# Altium project Condor2a.PrjPcb
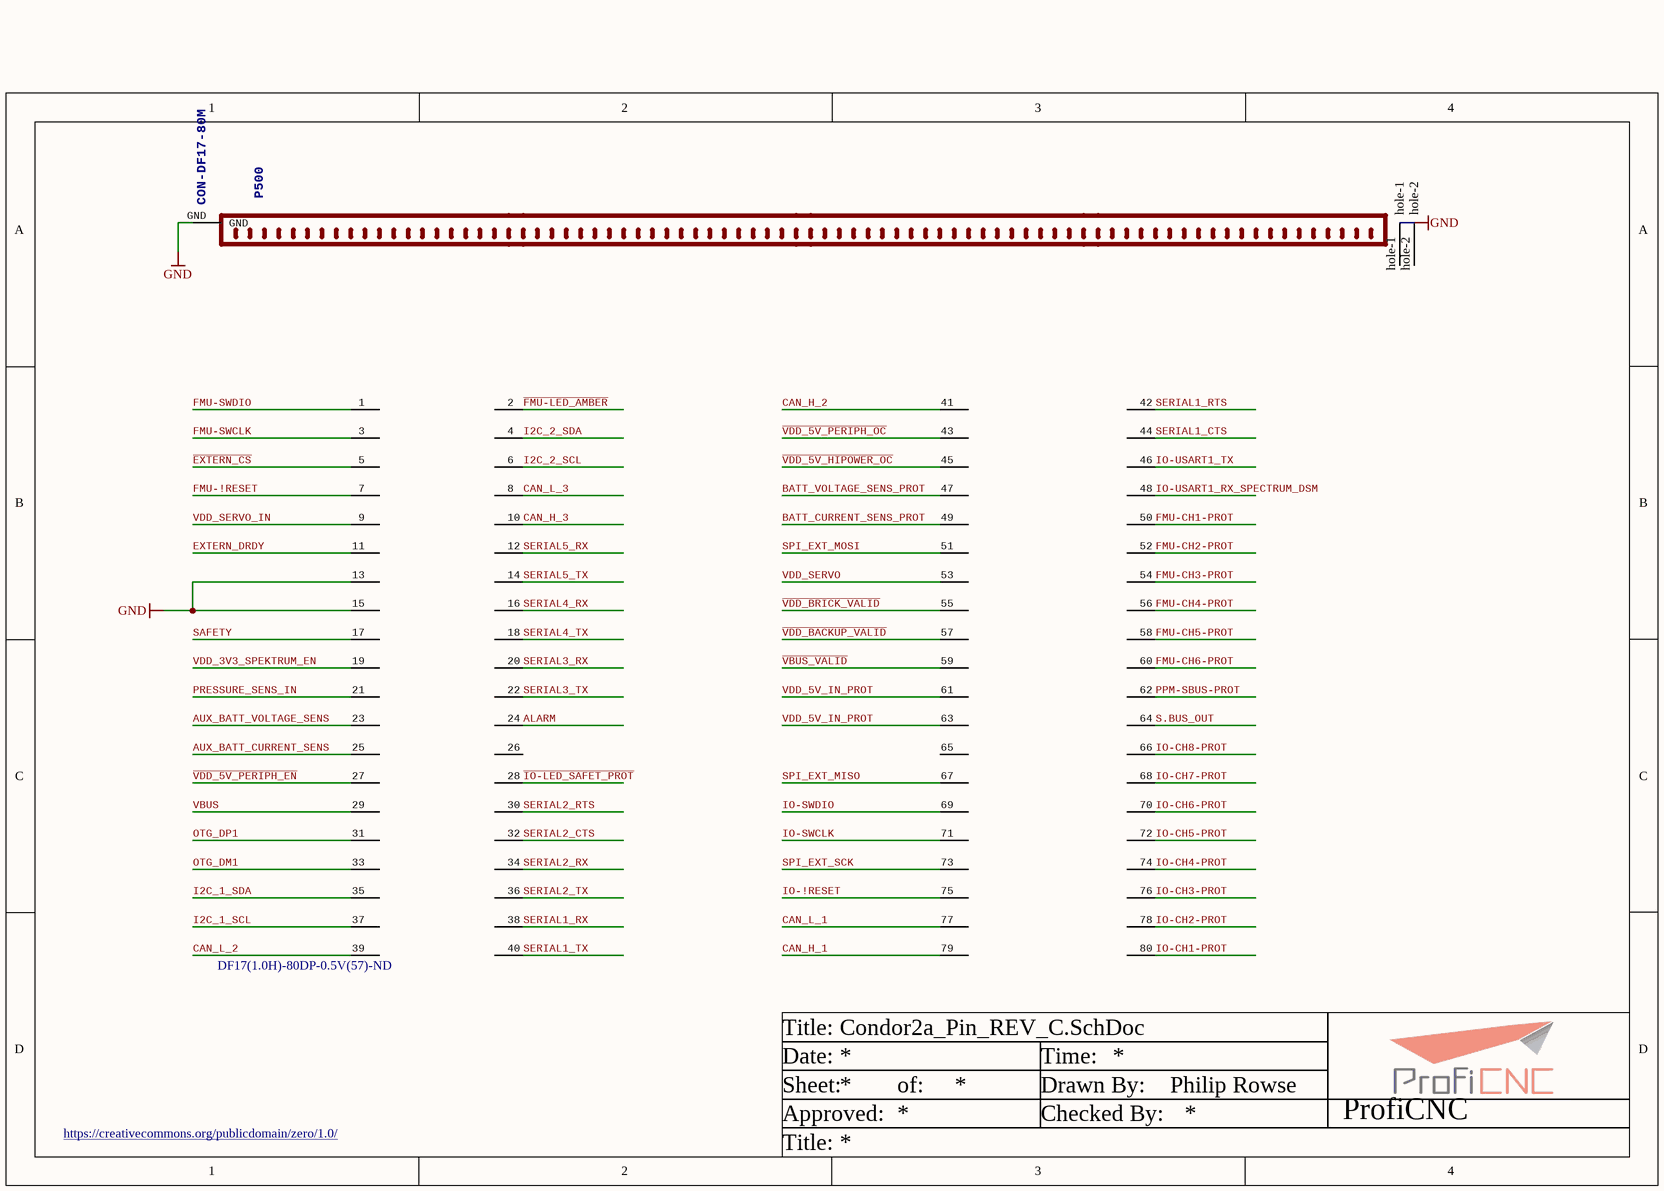
[diagram p0: Condor2a_Pin_REV_C.SchDoc]
10 sheets, 84 parts. Net scope: global (net labels, ports and power ports of the same name join across sheets).
Board file: Condor2a.PcbDoc
Sheets:
  Condor2a_Pin_REV_C.SchDoc
  Condor2a_INTEL_REV_C.SchDoc
  Condor2a_Plugs_REV_C.SchDoc
  Condor2a_Power_REV_C.SchDoc
  Condor2a_Servo_REV_C.SchDoc
  Condor2a_tp_REV_C.SchDoc
  Condor2a_ESC.SchDoc
  Condor2a_Power_Module.SchDoc
  Condor2a_Current_Sensor.SchDoc
  Condor2a_Herlink.SchDoc

## Sheet Condor2a_Pin_REV_C.SchDoc
size A4; DrawnBy: Philip Rowse

### Parts
P500  CON-DF17-80M  Supplier Part Number 1: DF17(1.0H)-80DP-0.5V(57)-ND  [CON-DF17-80M]

### Nets
GND: P500.13 P500.15 P500.GND
ALARM: P500.24
AUX_BATT_CURRENT_SENS: P500.25
AUX_BATT_VOLTAGE_SENS: P500.23
BATT_CURRENT_SENS_PROT: P500.49
BATT_VOLTAGE_SENS_PROT: P500.47
CAN_H_1: P500.79
CAN_H_2: P500.41
CAN_H_3: P500.10
CAN_L_1: P500.77
CAN_L_2: P500.39
CAN_L_3: P500.8
~{EXTERN_CS}: P500.5
EXTERN_DRDY: P500.11
~{FMU-LED_AMBER}: P500.2
FMU-!RESET: P500.7
FMU-CH1-PROT: P500.50
FMU-CH2-PROT: P500.52
FMU-CH3-PROT: P500.54
FMU-CH4-PROT: P500.56
FMU-CH5-PROT: P500.58
FMU-CH6-PROT: P500.60
FMU-SWCLK: P500.3
FMU-SWDIO: P500.1
I2C_1_SCL: P500.37
I2C_1_SDA: P500.35
I2C_2_SCL: P500.6
I2C_2_SDA: P500.4
~{IO-LED_SAFET_PROT}: P500.28
IO-!RESET: P500.75
IO-CH1-PROT: P500.80
IO-CH2-PROT: P500.78
IO-CH3-PROT: P500.76
IO-CH4-PROT: P500.74
IO-CH5-PROT: P500.72
IO-CH6-PROT: P500.70
IO-CH7-PROT: P500.68
IO-CH8-PROT: P500.66
IO-SWCLK: P500.71
IO-SWDIO: P500.69
IO-USART1_RX_SPECTRUM_DSM: P500.48
IO-USART1_TX: P500.46
OTG_DM1: P500.33
OTG_DP1: P500.31
PPM-SBUS-PROT: P500.62
PRESSURE_SENS_IN: P500.21
S.BUS_OUT: P500.64
SAFETY: P500.17
SERIAL1_CTS: P500.44
SERIAL1_RTS: P500.42
SERIAL1_RX: P500.38
SERIAL1_TX: P500.40
SERIAL2_CTS: P500.32
SERIAL2_RTS: P500.30
SERIAL2_RX: P500.34
SERIAL2_TX: P500.36
SERIAL3_RX: P500.20
SERIAL3_TX: P500.22
SERIAL4_RX: P500.16
SERIAL4_TX: P500.18
SERIAL5_RX: P500.12
SERIAL5_TX: P500.14
SPI_EXT_MISO: P500.67
SPI_EXT_MOSI: P500.51
SPI_EXT_SCK: P500.73
~{VBUS_VALID}: P500.59
~{VDD_5V_HIPOWER_OC}: P500.45
~{VDD_5V_PERIPH_EN}: P500.27
~{VDD_5V_PERIPH_OC}: P500.43
~{VDD_BACKUP_VALID}: P500.57
~{VDD_BRICK_VALID}: P500.55
VBUS: P500.29
VDD_3V3_SPEKTRUM_EN: P500.19
VDD_5V_IN_PROT: P500.61 P500.63
VDD_SERVO: P500.53
VDD_SERVO_IN: P500.9

Not connected (* = marked no-connect by the designer): P500 26 65 hole-1 hole-2

### Notes on the sheet
- Title:
- Date:
- Time:
- https://creativecommons.org/publicdomain/zero/1.0/
- Sheet:
- Approved:
- of:
- Drawn By:
- Checked By:
- ProfiCNC

### Library data of the parts
P500 = CON-DF17-80M: Connector, Header, 80Pos, .5MM, DUAL, SMD, Au; Supplier 1: Digi-Key

## Sheet Condor2a_INTEL_REV_C.SchDoc
size A4; DrawnBy: Philip Rowse

### Notes on the sheet
- Title:
- Date:
- Time:
- https://creativecommons.org/publicdomain/zero/1.0/
- Sheet:
- Approved:
- of:
- Drawn By:
- Checked By:
- ProfiCNC

## Sheet Condor2a_Plugs_REV_C.SchDoc
size A4; DrawnBy: Philip Rowse
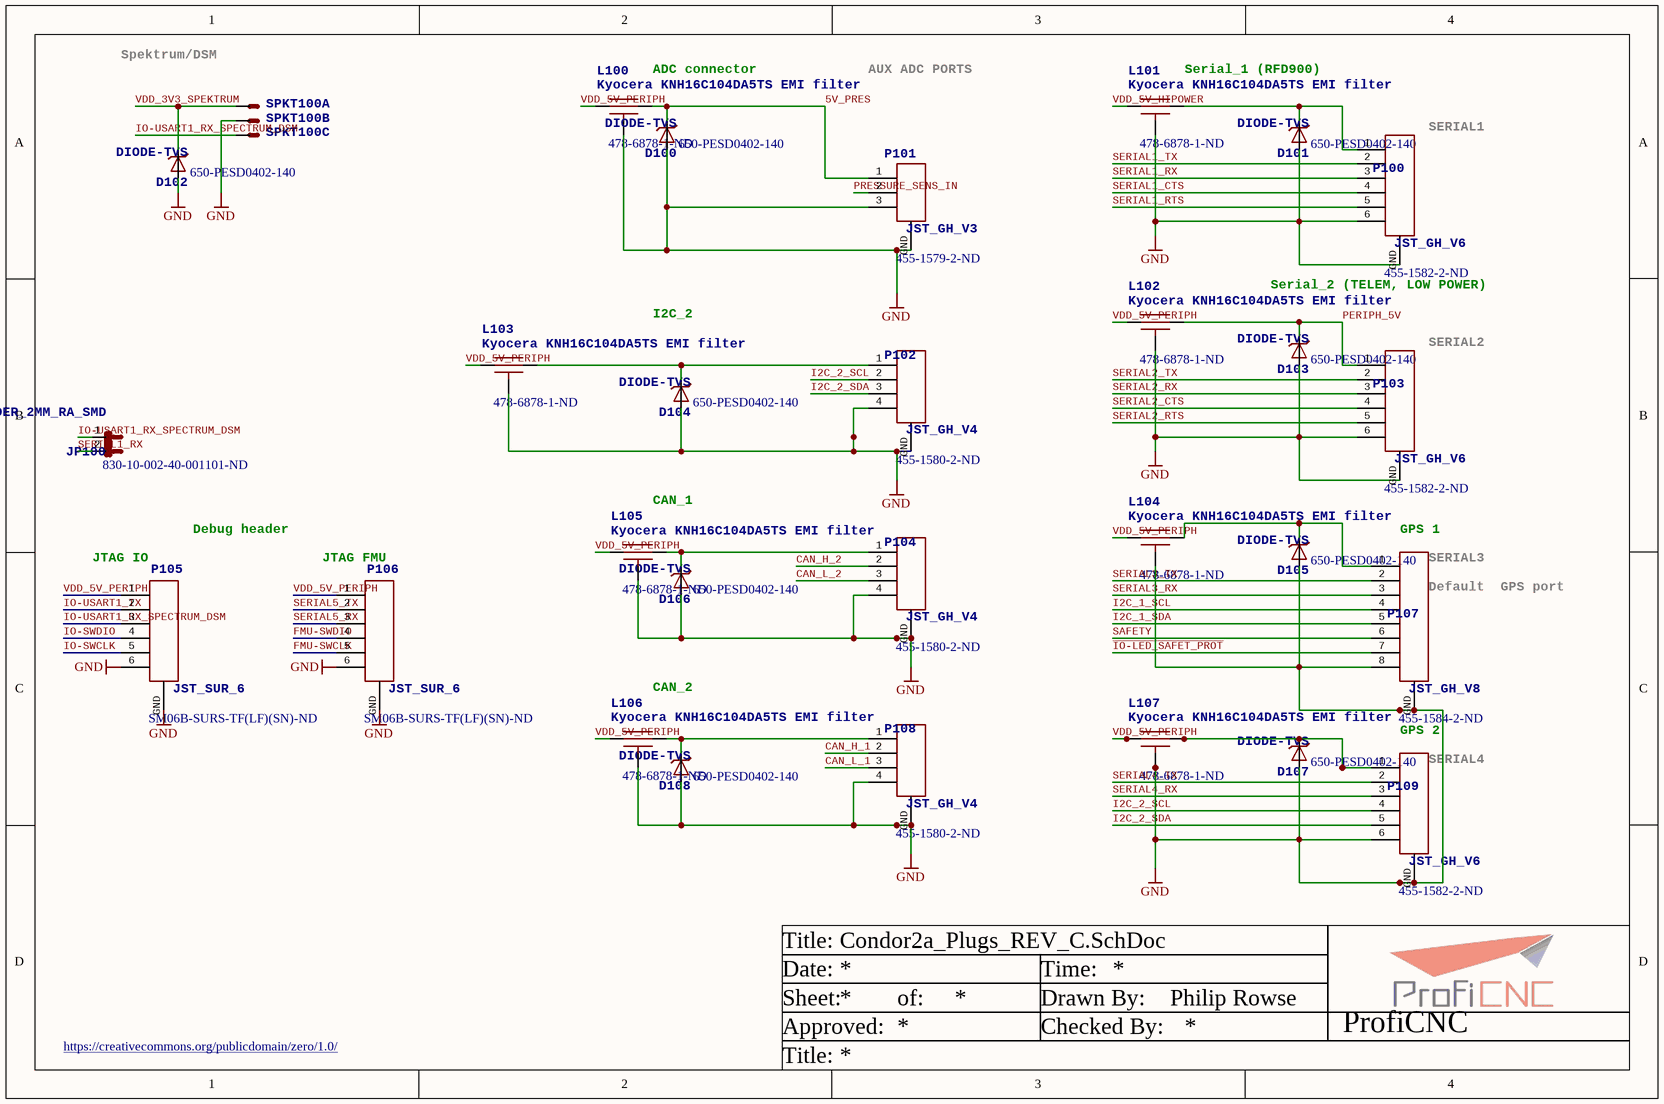
[diagram p1: Condor2a_Plugs_REV_C.SchDoc]

### Parts
D100  DIODE-TVS  Supplier Part Number 1: 650-PESD0402-140  [0402-TVS]
D101  DIODE-TVS  Supplier Part Number 1: 650-PESD0402-140  [0402-TVS]
D102  DIODE-TVS  Supplier Part Number 1: 650-PESD0402-140  [0402-TVS]
D103  DIODE-TVS  Supplier Part Number 1: 650-PESD0402-140  [0402-TVS]
D104  DIODE-TVS  Supplier Part Number 1: 650-PESD0402-140  [0402-TVS]
D105  DIODE-TVS  Supplier Part Number 1: 650-PESD0402-140  [0402-TVS]
D106  DIODE-TVS  Supplier Part Number 1: 650-PESD0402-140  [0402-TVS]
D107  DIODE-TVS  Supplier Part Number 1: 650-PESD0402-140  [0402-TVS]
D108  DIODE-TVS  Supplier Part Number 1: 650-PESD0402-140  [0402-TVS]
JP100  HEADER_2MM_RA_SMD  Supplier Part Number 1: 830-10-002-40-001101-ND  [HEADER_2MM_RA_2]
L100  Kyocera KNH16C104DA5TS EMI filter  Supplier Part Number 1: 478-6878-1-ND  [KYOCERA-KNH16-DA]
L101  Kyocera KNH16C104DA5TS EMI filter  Supplier Part Number 1: 478-6878-1-ND  [KYOCERA-KNH16-DA]
L102  Kyocera KNH16C104DA5TS EMI filter  Supplier Part Number 1: 478-6878-1-ND  [KYOCERA-KNH16-DA]
L103  Kyocera KNH16C104DA5TS EMI filter  Supplier Part Number 1: 478-6878-1-ND  [KYOCERA-KNH16-DA]
L104  Kyocera KNH16C104DA5TS EMI filter  Supplier Part Number 1: 478-6878-1-ND  [KYOCERA-KNH16-DA]
L105  Kyocera KNH16C104DA5TS EMI filter  Supplier Part Number 1: 478-6878-1-ND  [KYOCERA-KNH16-DA]
L106  Kyocera KNH16C104DA5TS EMI filter  Supplier Part Number 1: 478-6878-1-ND  [KYOCERA-KNH16-DA]
L107  Kyocera KNH16C104DA5TS EMI filter  Supplier Part Number 1: 478-6878-1-ND  [KYOCERA-KNH16-DA]
P100  JST_GH_V6  Supplier Part Number 1: 455-1582-2-ND  [JST_GH_V6]
P101  JST_GH_V3  Supplier Part Number 1: 455-1579-2-ND  [JST_GH_V3]
P102  JST_GH_V4  Supplier Part Number 1: 455-1580-2-ND  [JST_GH_V4]
P103  JST_GH_V6  Supplier Part Number 1: 455-1582-2-ND  [JST_GH_V6]
P104  JST_GH_V4  Supplier Part Number 1: 455-1580-2-ND  [JST_GH_V4]
P105  JST_SUR_6  Supplier Part Number 1: SM06B-SURS-TF(LF)(SN)-ND  [JST_SUR_H6]
P106  JST_SUR_6  Supplier Part Number 1: SM06B-SURS-TF(LF)(SN)-ND  [JST_SUR_H6]
P107  JST_GH_V8  Supplier Part Number 1: 455-1584-2-ND  [JST_GH_V8]
P108  JST_GH_V4  Supplier Part Number 1: 455-1580-2-ND  [JST_GH_V4]
P109  JST_GH_V6  Supplier Part Number 1: 455-1582-2-ND  [JST_GH_V6]
SPKT100  CONN_SPEKTRUM_RX-TH  [B3B-ZR]  (value not drawn)  (parts A,B,C of 3)

### Nets
GND: D100.A D101.A D102.A D103.A D104.A D105.A D106.A D107.A D108.A L100.GND L101.GND L102.GND L103.GND L104.GND L105.GND L106.GND L107.GND P100.6 P100.GND P101.3 P101.GND P102.4 P102.GND P103.6 P103.GND P104.4 P104.GND P105.6 P105.GND P106.6 P106.GND P107.8 P107.GND P108.4 P108.GND P109.6 P109.GND SPKT100.2(S)
5V_PRES: D100.C L100.P$2 P101.1
CAN_H_1: P108.2
CAN_H_2: P104.2
CAN_L_1: P108.3
CAN_L_2: P104.3
FMU-SWCLK: P106.5
FMU-SWDIO: P106.4
I2C_1_SCL: P107.4
I2C_1_SDA: P107.5
I2C_2_SCL: P102.2 P109.4
I2C_2_SDA: P102.3 P109.5
~{IO-LED_SAFET_PROT}: P107.7
IO-SWCLK: P105.5
IO-SWDIO: P105.4
IO-USART1_RX_SPECTRUM_DSM: JP100.1 P105.3 SPKT100.1(S)
IO-USART1_TX: P105.2
PERIPH_5V: D103.C L102.P$2 P103.1
PRESSURE_SENS_IN: P101.2
SAFETY: P107.6
SERIAL1_CTS: P100.4
SERIAL1_RTS: P100.5
SERIAL1_RX: JP100.2 P100.3
SERIAL1_TX: P100.2
SERIAL2_CTS: P103.4
SERIAL2_RTS: P103.5
SERIAL2_RX: P103.3
SERIAL2_TX: P103.2
SERIAL3_RX: P107.3
SERIAL3_TX: P107.2
SERIAL4_RX: P109.3
SERIAL4_TX: P109.2
SERIAL5_RX: P106.3
SERIAL5_TX: P106.2
VDD_3V3_SPEKTRUM: D102.C SPKT100.3(S)
VDD_5V_HIPOWER: L101.P$1
VDD_5V_PERIPH: L100.P$1 L102.P$1 L103.P$1 L104.P$1 L105.P$1 L106.P$1 L107.P$1 P105.1 P106.1
NetD101_C: D101.C L101.P$2 P100.1
NetD104_C: D104.C L103.P$2 P102.1
NetD105_C: D105.C L104.P$2 P107.1
NetD106_C: D106.C L105.P$2 P104.1
NetD107_C: D107.C L107.P$2 P109.1
NetD108_C: D108.C L106.P$2 P108.1

### Notes on the sheet
- Spektrum/DSM
- (near L100) ADC connector
- AUX ADC PORTS
- (near L101) Serial_1 (RFD900)
- (near P100) SERIAL1
- I2C_2
- Serial_2 (TELEM, LOW POWER)
- (near P103) SERIAL2
- Debug header
- (near L105) CAN_1
- (near P107) GPS 1
- (near P105) JTAG IO
- (near P106) JTAG FMU
- (near P107) SERIAL3
- (near P107) Default
  GPS port
- (near L106) CAN_2
- GPS 2
- (near P109) SERIAL4
- Title:
- Date:
- Time:
- https://creativecommons.org/publicdomain/zero/1.0/
- Sheet:
- Approved:
- of:
- Drawn By:
- Checked By:
- ProfiCNC

### Library data of the parts
D100-D108 = DIODE-TVS: Diode, TVS, 14VWM, 40VC, 0402, SMD; Supplier 1: Mouser
JP100 = HEADER_2MM_RA_SMD: Connector, PCB, 2MM, 2Pos, R/A, SMD, Au; Supplier 1: Digi-Key
L100-L107 = KNH16C104DA5TS: Capacitor, Filter, 0.1uF, 25V, 2A, 0603, SMD; Supplier 1: Digi-Key
P100 P103 P109 = JST_GH_V6: BM06B-GHS-TBT; Supplier 1: Digi-Key
P101 = JST_GH_V3: BM03B-GHS-TBT; Supplier 1: Digi-Key
P102 P104 P108 = JST_GH_V4: BM04B-GHS-TBT; Supplier 1: Digi-Key
P105 P106 = JST_SUR_6: Connector, Header, 6Pos, .8mm IDC, R/A, SMD, Tin; Supplier 1: Digi-Key
P107 = JST_GH_V8: BM08B-GHS-TBT; Supplier 1: Digi-Key
SPKT100 = CONN_SPEKTRUM_RX-TH: Spektrum RX connector; JST ZH series S3B-ZR-SM4A-TF; PARTNO: B3B-ZR(LF)(SN)

## Sheet Condor2a_Power_REV_C.SchDoc
size A4; DrawnBy: Philip Rowse
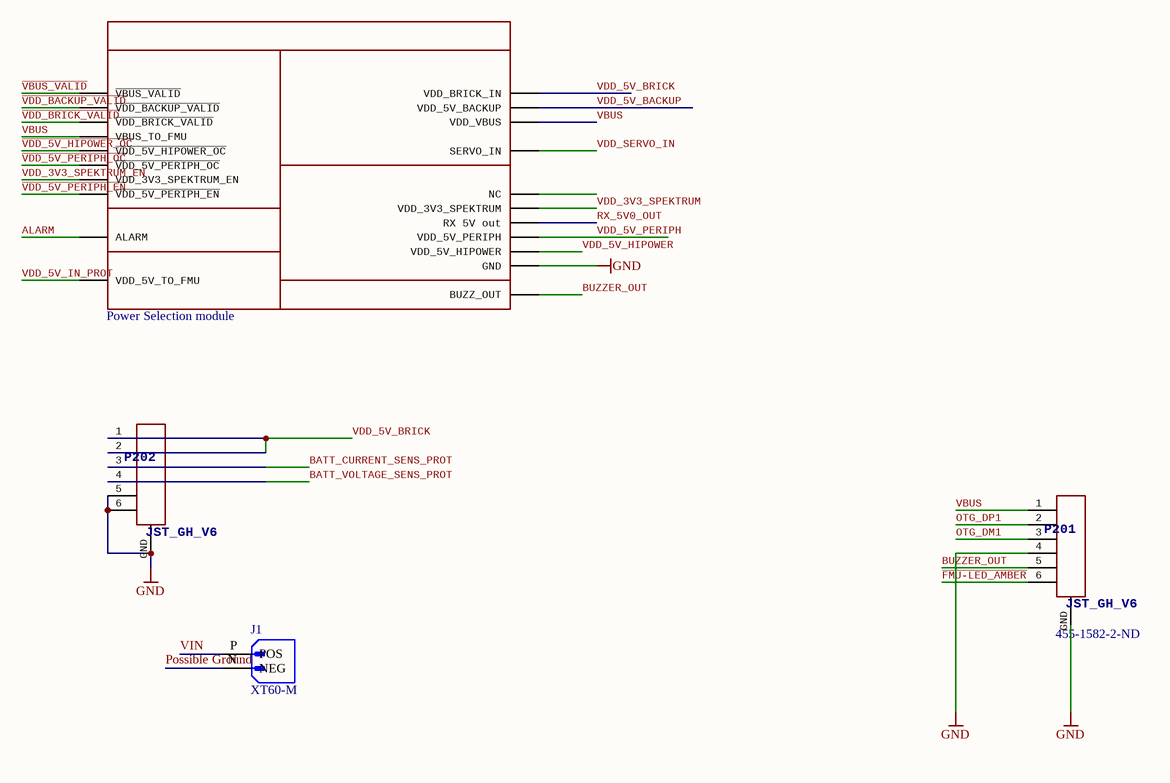
[diagram p2: Condor2a_Power_REV_C.SchDoc]

### Parts
J1  XT60-M  [AMASS_XT60-M]
P201  JST_GH_V6  Supplier Part Number 1: 455-1582-2-ND  [JST_GH_V6]
P202  JST_GH_V6  [JST_GH_V6]
PSM200  Power Selection module  [PSM]

### Nets
GND: P201.4 P201.GND P202.5 P202.6 P202.GND PSM200.GND
ALARM: PSM200.ALARM
BATT_CURRENT_SENS_PROT: P202.3
BATT_VOLTAGE_SENS_PROT: P202.4
BUZZER_OUT: P201.5 PSM200.BUZZER_OUT(BUZZ_OUT)
~{FMU-LED_AMBER}: P201.6
OTG_DM1: P201.3
OTG_DP1: P201.2
Possible Ground : J1.N(NEG)
RX_5V0_OUT: PSM200.RX(RX_5V_out)
~{VBUS_VALID}: PSM200.!VBUS_VALID(~{VBUS_VALID})
~{VDD_5V_HIPOWER_OC}: PSM200.!VDD_5V_HIPOWER_OC(~{VDD_5V_HIPOWER_OC})
~{VDD_5V_PERIPH_EN}: PSM200.!VDD_5V_PERIPH_EN(~{VDD_5V_PERIPH_EN})
~{VDD_5V_PERIPH_OC}: PSM200.!VDD_5V_PERIPH_OC(~{VDD_5V_PERIPH_OC})
~{VDD_BACKUP_VALID}: PSM200.!VDD_BACKUP_VALID(~{VDD_BACKUP_VALID})
~{VDD_BRICK_VALID}: PSM200.!VDD_BRICK_VALID(~{VDD_BRICK_VALID})
VBUS: P201.1 PSM200.VBUS(VBUS_TO_FMU) PSM200.VDD_VBUS
VDD_3V3_SPEKTRUM: PSM200.SPEK(VDD_3V3_SPEKTRUM)
VDD_3V3_SPEKTRUM_EN: PSM200.VDD_3V3_SPEKTRUM_EN
VDD_5V_BACKUP: PSM200.VDD_5V_BACKUP
VDD_5V_BRICK: P202.1 P202.2 PSM200.VDD_BRICK_IN
VDD_5V_HIPOWER: PSM200.5V_HIPOWER(VDD_5V_HIPOWER)
VDD_5V_IN_PROT: PSM200.VDD_5V_IN_PROT(VDD_5V_TO_FMU)
VDD_5V_PERIPH: PSM200.5V_PERIPH(VDD_5V_PERIPH)
VDD_SERVO_IN: PSM200.SERVO_IN
VIN: J1.P(POS)

Not connected (* = marked no-connect by the designer): PSM200 NC

### Notes on the sheet
- Title:
- Date:
- Time:
- https://creativecommons.org/publicdomain/zero/1.0/
- Sheet:
- Approved:
- of:
- Drawn By:
- Checked By:
- ProfiCNC

### Library data of the parts
J1 = XT60-M: Plug; DC supply; XT60; male; PIN: 2; for cable; soldered; 30A; 500V; MF: AMASS; Price: None; Availability: Not in stock; Package: Package; MP: XT60-M; Value: *; SnapEDA_Link: https://www.snapeda.com/parts/XT60-M/AMASS/view-part/?ref=snap; Check_prices: https://www.snapeda.com/parts/XT60-M/AMASS/view-part/?ref=eda
P201 P202 = JST_GH_V6: BM06B-GHS-TBT; Supplier 1: Digi-Key
PSM200 = PSMPSM: PCA, PSM, Assembly

## Sheet Condor2a_Servo_REV_C.SchDoc
size A4; DrawnBy: Philip Rowse
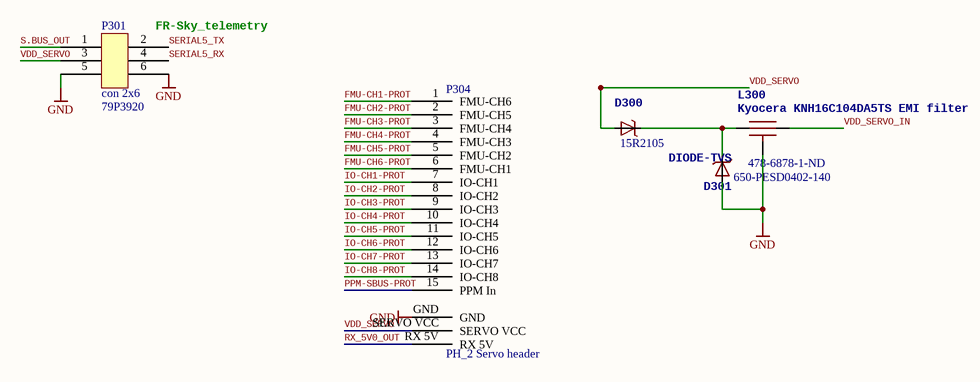
[diagram p3: Condor2a_Servo_REV_C.SchDoc]

### Parts
D300  Supplier Part Number 1: 15R2105  [MICROSMP]  (hidden comment: MSS1P4-M3)
D301  DIODE-TVS  Supplier Part Number 1: 650-PESD0402-140  [0402-TVS]
L300  Kyocera KNH16C104DA5TS EMI filter  Supplier Part Number 1: 478-6878-1-ND  [KYOCERA-KNH16-DA]
P301  con 2x6  Supplier Part Number 1: 79P3920  [TSW-103-07-G-D]
P304  PH_2 Servo header  [TSW-115-08-G-T-RA]

### Nets
GND: D301.A L300.GND P301.5 P301.6 P304.GND
FMU-CH1-PROT: P304.1(FMU-CH6)
FMU-CH2-PROT: P304.2(FMU-CH5)
FMU-CH3-PROT: P304.3(FMU-CH4)
FMU-CH4-PROT: P304.4(FMU-CH3)
FMU-CH5-PROT: P304.5(FMU-CH2)
FMU-CH6-PROT: P304.6(FMU-CH1)
IO-CH1-PROT: P304.7(IO-CH1)
IO-CH2-PROT: P304.8(IO-CH2)
IO-CH3-PROT: P304.9(IO-CH3)
IO-CH4-PROT: P304.10(IO-CH4)
IO-CH5-PROT: P304.11(IO-CH5)
IO-CH6-PROT: P304.12(IO-CH6)
IO-CH7-PROT: P304.13(IO-CH7)
IO-CH8-PROT: P304.14(IO-CH8)
PPM-SBUS-PROT: P304.15(PPM_In)
RX_5V0_OUT: P304.RX_5V
S.BUS_OUT: P301.1
SERIAL5_RX: P301.4
SERIAL5_TX: P301.2
VDD_SERVO: D300.ANODE(A) P301.3 P304.SERVO_VCC
VDD_SERVO_IN: L300.P$2
NetD300_CATHODE: D300.CATHODE(C) D301.C L300.P$1

### Notes on the sheet
- (near P301) FR-Sky_telemetry
- Title
- Size:
- Date:
- A4
- Number:
- Time:
- Revision:
- Sheet
- of
- File:

### Library data of the parts
D300 = DIODE-SCHOTTKY_MSMP: Diode, Schottky, 40V, 1A, MicroSMP, SMD; Supplier 1: Newark
D301 = DIODE-TVS: Diode, TVS, 14VWM, 40VC, 0402, SMD; Supplier 1: Mouser
L300 = KNH16C104DA5TS: as L100 on sheet Condor2a_Plugs_REV_C; Supplier 1: Digi-Key
P301 = con 2x6: Connector, Header, 6Pos, 2.54MM, Vert, THT, Au; Supplier 1: Newark
P304 = PH_2 Servo header: Connector, Header, 45Pos, 2.54MM, R/A, THT, Tin

## Sheet Condor2a_tp_REV_C.SchDoc
size A4; DrawnBy: Philip Rowse
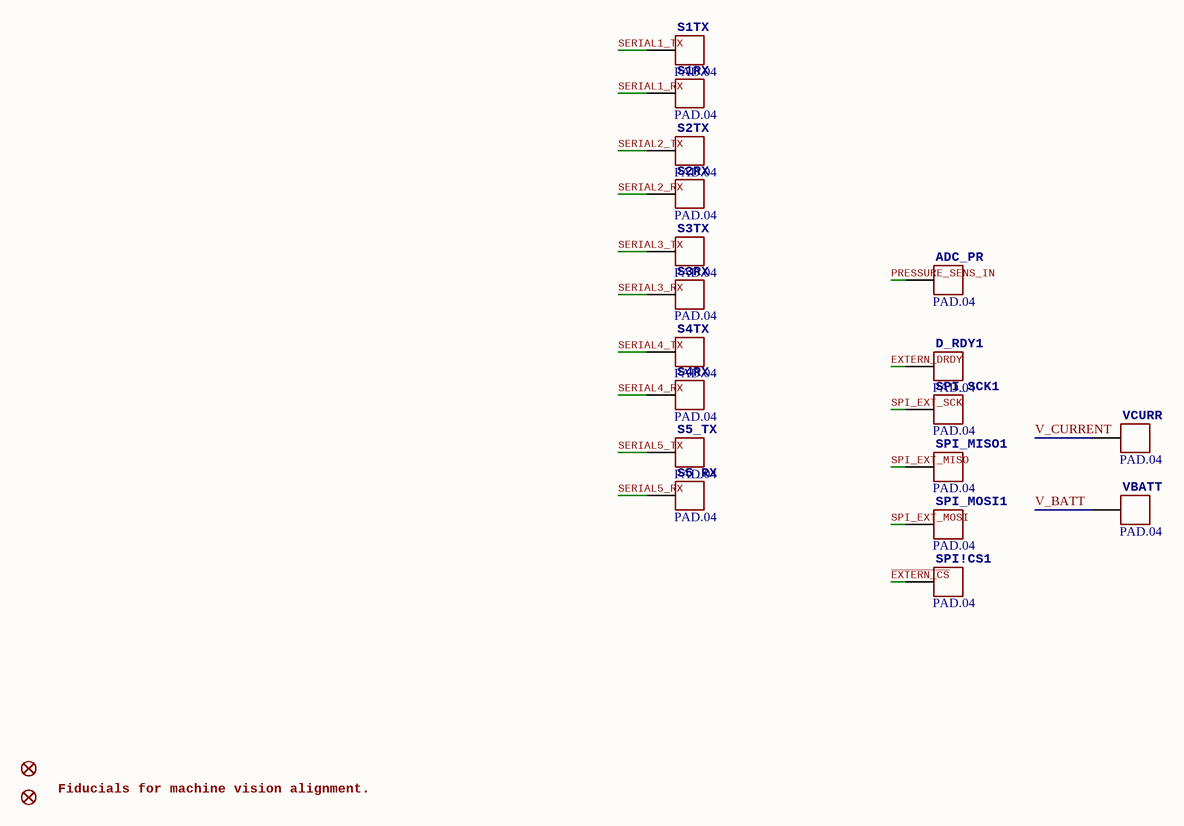
[diagram p4: Condor2a_tp_REV_C.SchDoc]

### Parts
ADC_PR  PAD.04  [PAD.04X.04]
D_RDY1  PAD.04  [PAD.04X.04]
JP400  FIDUCIAL1.5X3  (value not drawn)
JP401  FIDUCIAL1.5X3  (value not drawn)
S1RX  PAD.04  [PAD.04X.04]
S1TX  PAD.04  [PAD.04X.04]
S2RX  PAD.04  [PAD.04X.04]
S2TX  PAD.04  [PAD.04X.04]
S3RX  PAD.04  [PAD.04X.04]
S3TX  PAD.04  [PAD.04X.04]
S4RX  PAD.04  [PAD.04X.04]
S4TX  PAD.04  [PAD.04X.04]
S5_RX  PAD.04  [PAD.04X.04]
S5_TX  PAD.04  [PAD.04X.04]
SPI!CS1  PAD.04  [PAD.04X.04]
SPI_MISO1  PAD.04  [PAD.04X.04]
SPI_MOSI1  PAD.04  [PAD.04X.04]
SPI_SCK1  PAD.04  [PAD.04X.04]
VBATT  PAD.04  [PAD.04X.04]
VCURR  PAD.04  [PAD.04X.04]

### Nets
~{EXTERN_CS}: SPI!CS1.P$1
EXTERN_DRDY: D_RDY1.P$1
PRESSURE_SENS_IN: ADC_PR.P$1
SERIAL1_RX: S1RX.P$1
SERIAL1_TX: S1TX.P$1
SERIAL2_RX: S2RX.P$1
SERIAL2_TX: S2TX.P$1
SERIAL3_RX: S3RX.P$1
SERIAL3_TX: S3TX.P$1
SERIAL4_RX: S4RX.P$1
SERIAL4_TX: S4TX.P$1
SERIAL5_RX: S5_RX.P$1
SERIAL5_TX: S5_TX.P$1
SPI_EXT_MISO: SPI_MISO1.P$1
SPI_EXT_MOSI: SPI_MOSI1.P$1
SPI_EXT_SCK: SPI_SCK1.P$1
V_BATT: VBATT.P$1
V_CURRENT: VCURR.P$1

### Notes on the sheet
- Fiducials for machine
  vision alignment.
- Title:
- Date:
- Time:
- https://creativecommons.org/publicdomain/zero/1.0/
- Sheet:
- Approved:
- of:
- Drawn By:
- Checked By:
- ProfiCNC

### Library data of the parts
JP400 JP401 = FIDUCIAL1.5X3: machine vision alignment.; BOM: EXCLUDE; PARTNO: *

## Sheet Condor2a_ESC.SchDoc
size A4
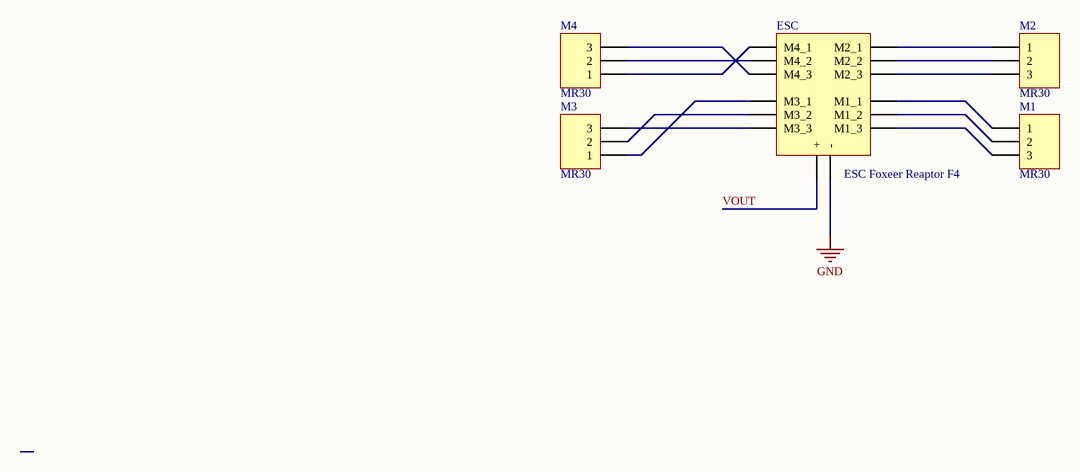
[diagram p5: Condor2a_ESC.SchDoc]

### Parts
ESC  ESC Foxeer Reaptor F4  [FOXEeR REAPER]
M1  MR30  [MR30]
M2  MR30  [MR30]
M3  MR30  [MR30]
M4  MR30  [MR30]

### Nets
GND: ESC.8(-)
VOUT: ESC.7(+)
NetESC_1: ESC.1(M4_1) M4.1
NetESC_2: ESC.2(M4_2) M4.2
NetESC_3: ESC.3(M4_3) M4.3
NetESC_4: ESC.4(M3_1) M3.1
NetESC_5: ESC.5(M3_2) M3.2
NetESC_6: ESC.6(M3_3) M3.3
NetESC_9: ESC.9(M1_3) M1.3
NetESC_10: ESC.10(M1_2) M1.2
NetESC_11: ESC.11(M1_1) M1.1
NetESC_12: ESC.12(M2_3) M2.3
NetESC_13: ESC.13(M2_2) M2.2
NetESC_14: ESC.14(M2_1) M2.1

### Library data of the parts
M1-M4 = MR30: LatestRevisionDate: 17-Jul-2002; LatestRevisionNote: Re-released for DXP Platform.; Publisher: Altium Limited

## Sheet Condor2a_Power_Module.SchDoc
size A4
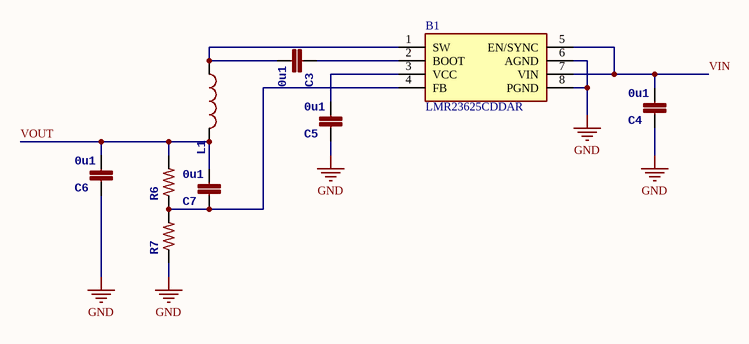
[diagram p6: Condor2a_Power_Module.SchDoc]

### Parts
B1  LMR23625CDDAR  [SOT127P600X170-8N]
C3  0u1  [0402-CAP]
C4  0u1  [0402-CAP]
C5  0u1  [0402-CAP]
C6  0u1  [0402-CAP]
C7  0u1  [0402-CAP]
L1  INDUCTOR0805  [0805-IND]  (value not drawn)
R6  RESISTOR0402-RES  [0402-RES]  (value not drawn)
R7  RESISTOR0402-RES  [0402-RES]  (value not drawn)

### Nets
GND: B1.6(AGND) B1.8(PGND) C4.P$2 C5.P$2 C6.P$2 R7.P1
VIN: B1.5(EN/SYNC) B1.7(VIN) C4.P$1
VOUT: C6.P$1 C7.P$1 L1.P$2 R6.P2
NetB1_1: B1.1(SW) C3.P$1 L1.P$1
NetB1_2: B1.2(BOOT) C3.P$2
NetB1_3: B1.3(VCC) C5.P$1
NetB1_4: B1.4(FB) C7.P$2 R6.P1 R7.P2

### Library data of the parts
B1 = LMR23625CDDAR: SIMPLE SWITCHER, 36V 2.5A Synchronous Step-Down Converter; Manufacturer_Name: Texas Instruments; Geometry.Height: 1.7mm; Mouser Part Number: 595-LMR23625CDDAR; Mouser Price/Stock: https://www.mouser.co.uk/ProductDetail/Texas-Instruments/LMR23625CDDAR?qs=8%2FmU9qzJpL%2FuNiFnLdW2uw%3D%3D; Manufacturer_Part_Number: LMR23625CDDAR; Datasheet Link: http://www.ti.com/lit/gpn/lmr23625
C3-C7 = CAP0402: PARTNO: CC0402ZRY5V7BB104; Supplier 1: Digi-Key
  C3-C5 C7: Supplier Part Number 1: 311-1047-1-ND
L1 = INDUCTOR0805: Supplier 1: Digi-Key; Supplier Part Number 1: 240-2389-6-ND

## Sheet Condor2a_Current_Sensor.SchDoc
size A4
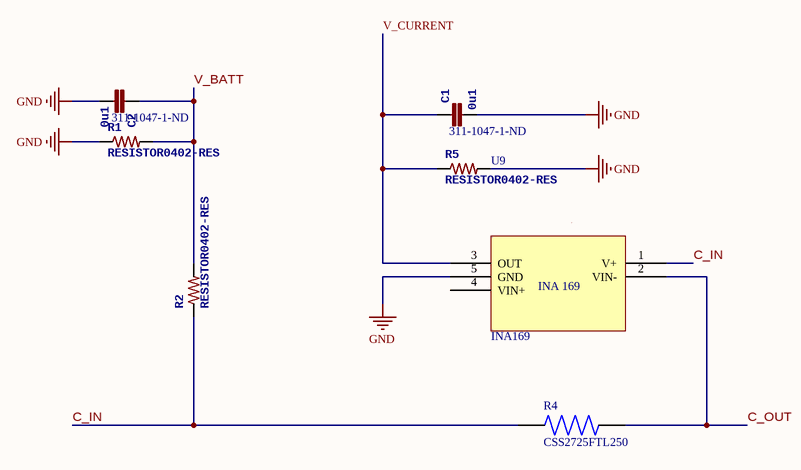
[diagram p7: Condor2a_Current_Sensor.SchDoc]

### Parts
C1  0u1  Supplier Part Number 1: 311-1047-1-ND  [0402-CAP]
C2  0u1  Supplier Part Number 1: 311-1047-1-ND  [0402-CAP]
R1  RESISTOR0402-RES  [0402-RES]
R2  RESISTOR0402-RES  [0402-RES]
R4  CSS2725FTL250  [RESC6864X124N]
R5  RESISTOR0402-RES  [0402-RES]
U9  INA169  [INA169]

### Nets
GND: C1.P$1 C2.P$1 R1.P1 R5.P2 U9.5(GND)
C_IN: R2.P1 R4.1 U9.1(V+)
C_OUT: R4.2 U9.2(VIN-)
V_BATT: C2.P$2 R1.P2 R2.P2
V_CURRENT: C1.P$2 R5.P1 U9.3(OUT)

Not connected (* = marked no-connect by the designer): U9 4(VIN+)

### Notes on the sheet
- (in symbol INA169) INA 169

### Library data of the parts
C1 C2 = CAP0402: PARTNO: CC0402ZRY5V7BB104; Supplier 1: Digi-Key
R4 = CSS2725FTL250: 250 ÂµOhms Â±1% 4W Chip Resistor Nonstandard Automotive AEC-Q200, Current Sense Metal Element; MF: Stackpole Electronics Inc; Purchase-URL: https://pricing.snapeda.com/search/part/CSS2725FTL250/?ref=eda; Package: 6864 Stackpole; Check_prices: https://www.snapeda.com/parts/CSS2725FTL250/Stackpole%20Electronics%20Inc/view-part/4222273/?ref=eda; Digi-Key_Part_Number: CSS2725FTL250CT-ND; Value: *; MP: CSS2725FTL250; SnapEDA_Link: https://www.snapeda.com/parts/CSS2725FTL250/Stackpole%20Electronics%20Inc/view-part/4222273/?ref=snap

## Sheet Condor2a_Herlink.SchDoc
size A4
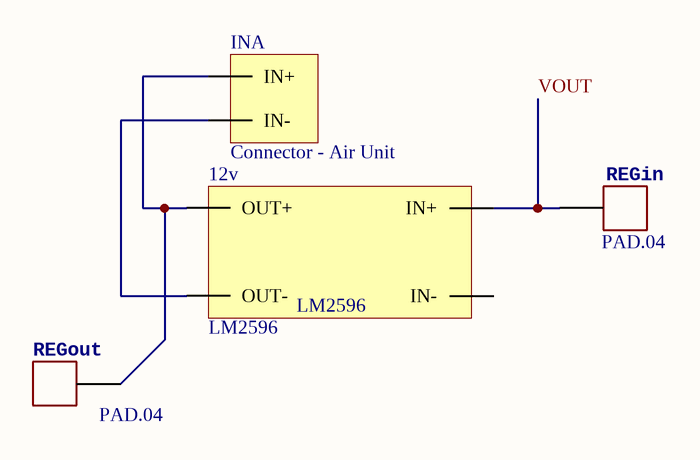
[diagram p8: Condor2a_Herlink.SchDoc]

### Parts
12v  LM2596  [LM2596 DC-DC HW-411]
INA  Connector - Air Unit  [Connector - Air Unir]
REGin  PAD.04  [PAD.04X.04]
REGout  PAD.04  [PAD.04X.04]

### Nets
VOUT: 12v.IN+ REGin.P$1
Net12v_OUT+: 12v.OUT+ INA.1(IN+) REGout.P$1
Net12v_OUT-: 12v.OUT- INA.2(IN-)

Not connected (* = marked no-connect by the designer): 12v IN-

## Nets that join several sheets
GND: Condor2a_Pin_REV_C (P500.13 P500.15 P500.GND), Condor2a_Plugs_REV_C (38 pins), Condor2a_Power_REV_C (6 pins), Condor2a_Servo_REV_C (5 pins), Condor2a_ESC (ESC.8), Condor2a_Power_Module (6 pins), Condor2a_Current_Sensor (5 pins)
ALARM: Condor2a_Pin_REV_C (P500.24), Condor2a_Power_REV_C (PSM200.ALARM)
BATT_CURRENT_SENS_PROT: Condor2a_Pin_REV_C (P500.49), Condor2a_Power_REV_C (P202.3)
BATT_VOLTAGE_SENS_PROT: Condor2a_Pin_REV_C (P500.47), Condor2a_Power_REV_C (P202.4)
CAN_H_1: Condor2a_Pin_REV_C (P500.79), Condor2a_Plugs_REV_C (P108.2)
CAN_H_2: Condor2a_Pin_REV_C (P500.41), Condor2a_Plugs_REV_C (P104.2)
CAN_L_1: Condor2a_Pin_REV_C (P500.77), Condor2a_Plugs_REV_C (P108.3)
CAN_L_2: Condor2a_Pin_REV_C (P500.39), Condor2a_Plugs_REV_C (P104.3)
~{EXTERN_CS}: Condor2a_Pin_REV_C (P500.5), Condor2a_tp_REV_C (SPI!CS1.P$1)
EXTERN_DRDY: Condor2a_Pin_REV_C (P500.11), Condor2a_tp_REV_C (D_RDY1.P$1)
~{FMU-LED_AMBER}: Condor2a_Pin_REV_C (P500.2), Condor2a_Power_REV_C (P201.6)
FMU-CH1-PROT: Condor2a_Pin_REV_C (P500.50), Condor2a_Servo_REV_C (P304.1)
FMU-CH2-PROT: Condor2a_Pin_REV_C (P500.52), Condor2a_Servo_REV_C (P304.2)
FMU-CH3-PROT: Condor2a_Pin_REV_C (P500.54), Condor2a_Servo_REV_C (P304.3)
FMU-CH4-PROT: Condor2a_Pin_REV_C (P500.56), Condor2a_Servo_REV_C (P304.4)
FMU-CH5-PROT: Condor2a_Pin_REV_C (P500.58), Condor2a_Servo_REV_C (P304.5)
FMU-CH6-PROT: Condor2a_Pin_REV_C (P500.60), Condor2a_Servo_REV_C (P304.6)
FMU-SWCLK: Condor2a_Pin_REV_C (P500.3), Condor2a_Plugs_REV_C (P106.5)
FMU-SWDIO: Condor2a_Pin_REV_C (P500.1), Condor2a_Plugs_REV_C (P106.4)
I2C_1_SCL: Condor2a_Pin_REV_C (P500.37), Condor2a_Plugs_REV_C (P107.4)
I2C_1_SDA: Condor2a_Pin_REV_C (P500.35), Condor2a_Plugs_REV_C (P107.5)
I2C_2_SCL: Condor2a_Pin_REV_C (P500.6), Condor2a_Plugs_REV_C (P102.2 P109.4)
I2C_2_SDA: Condor2a_Pin_REV_C (P500.4), Condor2a_Plugs_REV_C (P102.3 P109.5)
~{IO-LED_SAFET_PROT}: Condor2a_Pin_REV_C (P500.28), Condor2a_Plugs_REV_C (P107.7)
IO-CH1-PROT: Condor2a_Pin_REV_C (P500.80), Condor2a_Servo_REV_C (P304.7)
IO-CH2-PROT: Condor2a_Pin_REV_C (P500.78), Condor2a_Servo_REV_C (P304.8)
IO-CH3-PROT: Condor2a_Pin_REV_C (P500.76), Condor2a_Servo_REV_C (P304.9)
IO-CH4-PROT: Condor2a_Pin_REV_C (P500.74), Condor2a_Servo_REV_C (P304.10)
IO-CH5-PROT: Condor2a_Pin_REV_C (P500.72), Condor2a_Servo_REV_C (P304.11)
IO-CH6-PROT: Condor2a_Pin_REV_C (P500.70), Condor2a_Servo_REV_C (P304.12)
IO-CH7-PROT: Condor2a_Pin_REV_C (P500.68), Condor2a_Servo_REV_C (P304.13)
IO-CH8-PROT: Condor2a_Pin_REV_C (P500.66), Condor2a_Servo_REV_C (P304.14)
IO-SWCLK: Condor2a_Pin_REV_C (P500.71), Condor2a_Plugs_REV_C (P105.5)
IO-SWDIO: Condor2a_Pin_REV_C (P500.69), Condor2a_Plugs_REV_C (P105.4)
IO-USART1_RX_SPECTRUM_DSM: Condor2a_Pin_REV_C (P500.48), Condor2a_Plugs_REV_C (JP100.1 P105.3 SPKT100.1)
IO-USART1_TX: Condor2a_Pin_REV_C (P500.46), Condor2a_Plugs_REV_C (P105.2)
OTG_DM1: Condor2a_Pin_REV_C (P500.33), Condor2a_Power_REV_C (P201.3)
OTG_DP1: Condor2a_Pin_REV_C (P500.31), Condor2a_Power_REV_C (P201.2)
PPM-SBUS-PROT: Condor2a_Pin_REV_C (P500.62), Condor2a_Servo_REV_C (P304.15)
PRESSURE_SENS_IN: Condor2a_Pin_REV_C (P500.21), Condor2a_Plugs_REV_C (P101.2), Condor2a_tp_REV_C (ADC_PR.P$1)
RX_5V0_OUT: Condor2a_Power_REV_C (PSM200.RX), Condor2a_Servo_REV_C (P304.RX 5V)
S.BUS_OUT: Condor2a_Pin_REV_C (P500.64), Condor2a_Servo_REV_C (P301.1)
SAFETY: Condor2a_Pin_REV_C (P500.17), Condor2a_Plugs_REV_C (P107.6)
SERIAL1_CTS: Condor2a_Pin_REV_C (P500.44), Condor2a_Plugs_REV_C (P100.4)
SERIAL1_RTS: Condor2a_Pin_REV_C (P500.42), Condor2a_Plugs_REV_C (P100.5)
SERIAL1_RX: Condor2a_Pin_REV_C (P500.38), Condor2a_Plugs_REV_C (JP100.2 P100.3), Condor2a_tp_REV_C (S1RX.P$1)
SERIAL1_TX: Condor2a_Pin_REV_C (P500.40), Condor2a_Plugs_REV_C (P100.2), Condor2a_tp_REV_C (S1TX.P$1)
SERIAL2_CTS: Condor2a_Pin_REV_C (P500.32), Condor2a_Plugs_REV_C (P103.4)
SERIAL2_RTS: Condor2a_Pin_REV_C (P500.30), Condor2a_Plugs_REV_C (P103.5)
SERIAL2_RX: Condor2a_Pin_REV_C (P500.34), Condor2a_Plugs_REV_C (P103.3), Condor2a_tp_REV_C (S2RX.P$1)
SERIAL2_TX: Condor2a_Pin_REV_C (P500.36), Condor2a_Plugs_REV_C (P103.2), Condor2a_tp_REV_C (S2TX.P$1)
SERIAL3_RX: Condor2a_Pin_REV_C (P500.20), Condor2a_Plugs_REV_C (P107.3), Condor2a_tp_REV_C (S3RX.P$1)
SERIAL3_TX: Condor2a_Pin_REV_C (P500.22), Condor2a_Plugs_REV_C (P107.2), Condor2a_tp_REV_C (S3TX.P$1)
SERIAL4_RX: Condor2a_Pin_REV_C (P500.16), Condor2a_Plugs_REV_C (P109.3), Condor2a_tp_REV_C (S4RX.P$1)
SERIAL4_TX: Condor2a_Pin_REV_C (P500.18), Condor2a_Plugs_REV_C (P109.2), Condor2a_tp_REV_C (S4TX.P$1)
SERIAL5_RX: Condor2a_Pin_REV_C (P500.12), Condor2a_Plugs_REV_C (P106.3), Condor2a_Servo_REV_C (P301.4), Condor2a_tp_REV_C (S5_RX.P$1)
SERIAL5_TX: Condor2a_Pin_REV_C (P500.14), Condor2a_Plugs_REV_C (P106.2), Condor2a_Servo_REV_C (P301.2), Condor2a_tp_REV_C (S5_TX.P$1)
SPI_EXT_MISO: Condor2a_Pin_REV_C (P500.67), Condor2a_tp_REV_C (SPI_MISO1.P$1)
SPI_EXT_MOSI: Condor2a_Pin_REV_C (P500.51), Condor2a_tp_REV_C (SPI_MOSI1.P$1)
SPI_EXT_SCK: Condor2a_Pin_REV_C (P500.73), Condor2a_tp_REV_C (SPI_SCK1.P$1)
~{VBUS_VALID}: Condor2a_Pin_REV_C (P500.59), Condor2a_Power_REV_C (PSM200.!VBUS_VALID)
~{VDD_5V_HIPOWER_OC}: Condor2a_Pin_REV_C (P500.45), Condor2a_Power_REV_C (PSM200.!VDD_5V_HIPOWER_OC)
~{VDD_5V_PERIPH_EN}: Condor2a_Pin_REV_C (P500.27), Condor2a_Power_REV_C (PSM200.!VDD_5V_PERIPH_EN)
~{VDD_5V_PERIPH_OC}: Condor2a_Pin_REV_C (P500.43), Condor2a_Power_REV_C (PSM200.!VDD_5V_PERIPH_OC)
~{VDD_BACKUP_VALID}: Condor2a_Pin_REV_C (P500.57), Condor2a_Power_REV_C (PSM200.!VDD_BACKUP_VALID)
~{VDD_BRICK_VALID}: Condor2a_Pin_REV_C (P500.55), Condor2a_Power_REV_C (PSM200.!VDD_BRICK_VALID)
V_BATT: Condor2a_tp_REV_C (VBATT.P$1), Condor2a_Current_Sensor (C2.P$2 R1.P2 R2.P2)
V_CURRENT: Condor2a_tp_REV_C (VCURR.P$1), Condor2a_Current_Sensor (C1.P$2 R5.P1 U9.3)
VBUS: Condor2a_Pin_REV_C (P500.29), Condor2a_Power_REV_C (P201.1 PSM200.VBUS PSM200.VDD_VBUS)
VDD_3V3_SPEKTRUM: Condor2a_Plugs_REV_C (D102.C SPKT100.3), Condor2a_Power_REV_C (PSM200.SPEK)
VDD_3V3_SPEKTRUM_EN: Condor2a_Pin_REV_C (P500.19), Condor2a_Power_REV_C (PSM200.VDD_3V3_SPEKTRUM_EN)
VDD_5V_HIPOWER: Condor2a_Plugs_REV_C (L101.P$1), Condor2a_Power_REV_C (PSM200.5V_HIPOWER)
VDD_5V_IN_PROT: Condor2a_Pin_REV_C (P500.61 P500.63), Condor2a_Power_REV_C (PSM200.VDD_5V_IN_PROT)
VDD_5V_PERIPH: Condor2a_Plugs_REV_C (9 pins), Condor2a_Power_REV_C (PSM200.5V_PERIPH)
VDD_SERVO: Condor2a_Pin_REV_C (P500.53), Condor2a_Servo_REV_C (D300.ANODE P301.3 P304.SERVO VCC)
VDD_SERVO_IN: Condor2a_Pin_REV_C (P500.9), Condor2a_Power_REV_C (PSM200.SERVO_IN), Condor2a_Servo_REV_C (L300.P$2)
VIN: Condor2a_Power_REV_C (J1.P), Condor2a_Power_Module (B1.5 B1.7 C4.P$1)
VOUT: Condor2a_ESC (ESC.7), Condor2a_Power_Module (C6.P$1 C7.P$1 L1.P$2 R6.P2), Condor2a_Herlink (12v.IN+ REGin.P$1)

## Assembly variants
Normal_CB: not fitted ADC_PR BATT600 C600 C601 C602 C603 C604 C605 D_RDY1 EDISON600 JP400 JP401 L600 L601 LED600 LED601 LOGO1 LOGO2 LV600 LV601 LV602 LV603 LV604 LV605 M3_MOUNT901 M3_MOUNT902 M3_MOUNT903 M3_MOUNT904 Nut 600 Nut 601 P600 R600 R603 R605 R606 R607 R608 R609 R610 R611 R612 R613 S1RX S1TX S2RX S2TX S3RX S3TX S4RX S4TX S5_RX S5_TX S600 S601 S602 SPI!CS1 SPI_MISO1 SPI_MOSI1 SPI_SCK1 U601 U603 USB600 USB601
INTEL_CB: not fitted ADC_PR D_RDY1 EDISON600 JP400 JP401 LOGO1 LOGO2 M3_MOUNT901 M3_MOUNT902 M3_MOUNT903 M3_MOUNT904 S1RX S1TX S2RX S2TX S3RX S3TX S4RX S4TX S5_RX S5_TX SPI!CS1 SPI_MISO1 SPI_MOSI1 SPI_SCK1